# Altium project PCB_3U_Kasli.PrjPCB (part 1 of 6)
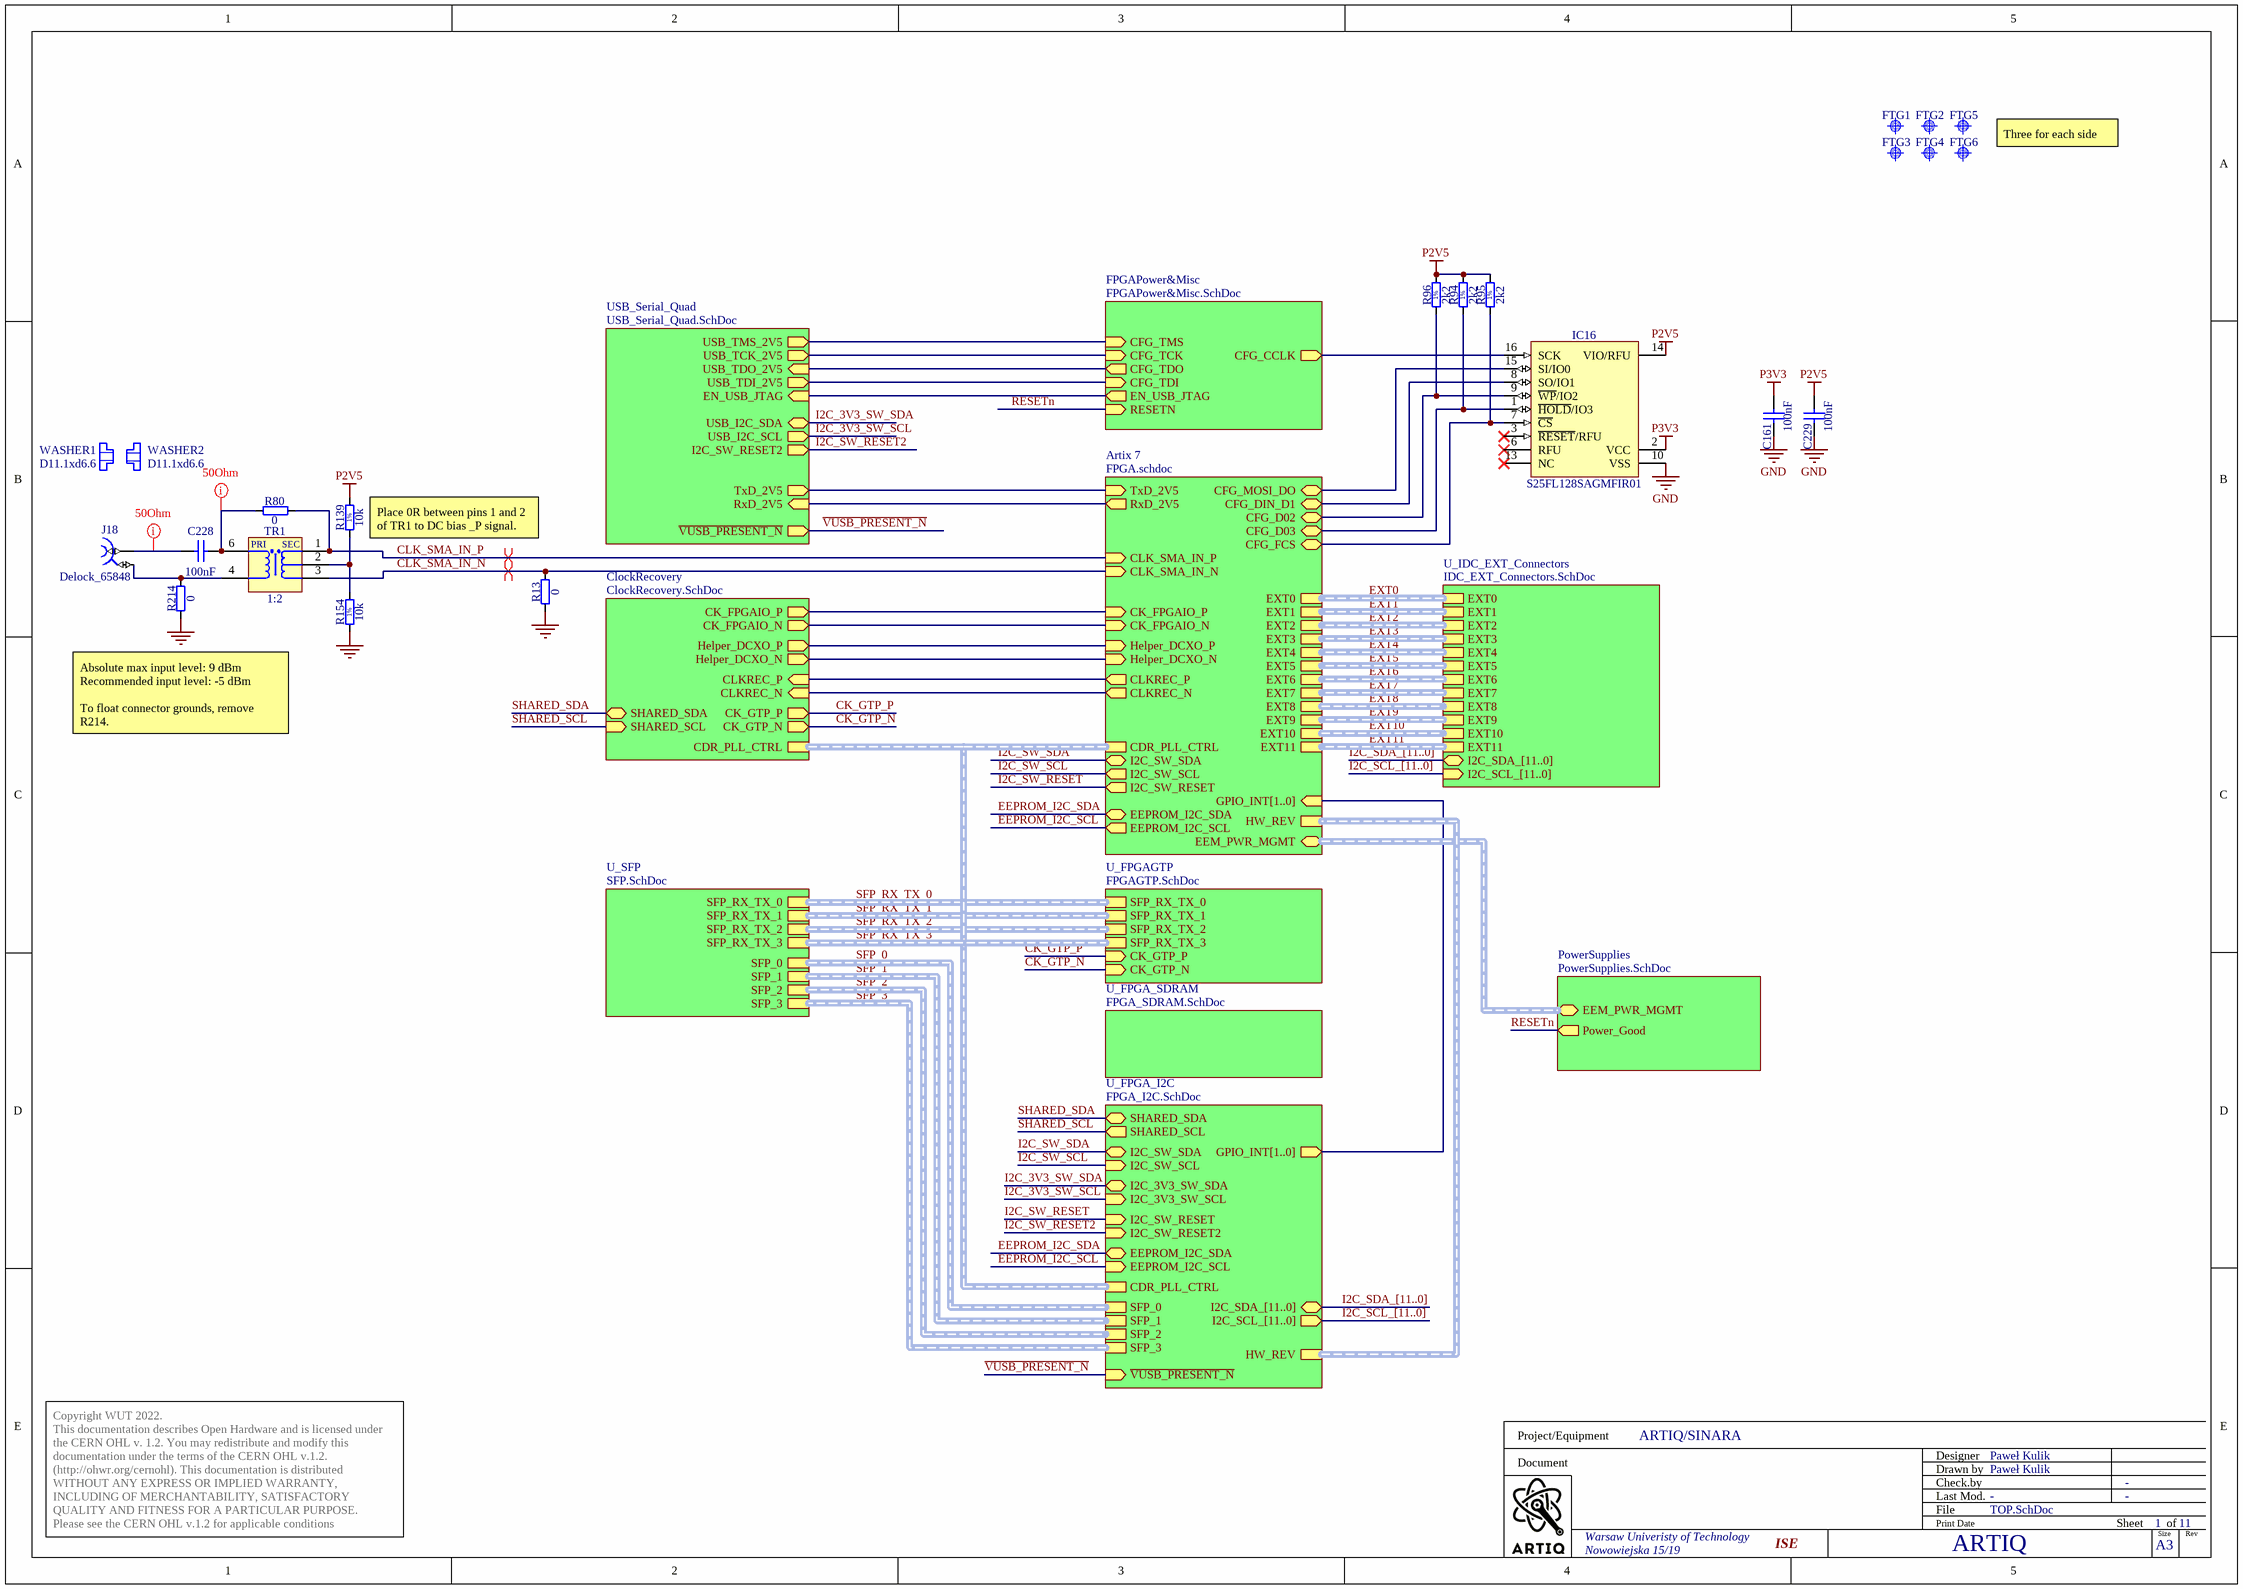
[diagram p0: TOP.SchDoc]
11 sheets, 786 parts. Net scope: hierarchical (ports join the sheet entries above them; power ports are global).
Board file: PCB_Kasli.PCBDOC
Sheets:
  TOP.SchDoc
    Artix 7 = FPGA.schdoc
    ClockRecovery = ClockRecovery.SchDoc
    PowerSupplies = PowerSupplies.SchDoc
    U_SFP = SFP.SchDoc
    FPGAPower&Misc = FPGAPower&Misc.SchDoc
    U_FPGAGTP = FPGAGTP.SchDoc
    U_FPGA_I2C = FPGA_I2C.SchDoc
    U_FPGA_SDRAM = FPGA_SDRAM.SchDoc
    U_IDC_EXT_Connectors = IDC_EXT_Connectors.SchDoc
    USB_Serial_Quad = USB_Serial_Quad.SchDoc

## Sheet TOP.SchDoc: =ProjectName
size 420 x 297 mm; Author: Paweł Kulik; CompanyName: WUT; DrawnBy: Paweł Kulik; Organization: WUT ISE; Address1: Warsaw Univeristy of Technology; Address2: Nowowiejska 15/19; DocumentNumber: 1; Revision: 2.0.2; SheetNumber: 1; SheetTotal: 11; EDA_Number: ARTIQ; Projet: ARTIQ/SINARA; ModifiedBy: -; CheckedDate: -; Title2: TOP.SchDoc; DivGrp: ISE; Designer: Paweł Kulik; ModifiedDate: -; ProjectName: ARTIQ/SINARA

### Parts
C161  100nF  [CAPC0603X33N]
C228  100nF  [CAPC0603X33N]
C229  100nF  [CAPC0603X33N]
FTG1  Use only in PCB  [FIDUCIAL_TOP_C100-200]  (value not drawn)  (no BOM)
FTG2  Use only in PCB  [FIDUCIAL_TOP_S100-200]  (value not drawn)  (no BOM)
FTG3  Use only in PCB  [FIDUCIAL_TOP_C100-200]  (value not drawn)  (no BOM)
FTG4  Use only in PCB  [FIDUCIAL_TOP_C100-200]  (value not drawn)  (no BOM)
FTG5  Use only in PCB  [FIDUCIAL_TOP_C100-200]  (value not drawn)  (no BOM)
FTG6  Use only in PCB  [FIDUCIAL_TOP_S100-200]  (value not drawn)  (no BOM)
IC16  S25FL128SAGMFIR01  [SOIC127P1030X265-16N]
J18  Delock_65848  [Delock_65848]
R13  0  [RESC1005X40N]
R80  0  [RESC1005X40N]
R94  2k2  [RESC1005X40N]
R95  2k2  [RESC1005X40N]
R96  2k2  [RESC1005X40N]
R139  10k  [RESC1005X40N]
R154  10k  [RESC1005X40N]
R214  0  [RESC1005X40N]
TR1  1:2  [XFMR_MINI-CIRCUITS_AT1521]
WASHER1  D11.1xd6.6  [Keystone_7687]
WASHER2  D11.1xd6.6  [Keystone_7687]

### Sub-sheets
Artix 7 = FPGA.schdoc: CLKREC_P (out), CLKREC_N (out), CK_FPGAIO_P (in), CK_FPGAIO_N (in), I2C_SW_SDA (bidir), I2C_SW_SCL (out), CFG_MOSI_DO (bidir), CFG_DIN_D1 (bidir), CFG_D02 (bidir), CFG_D03 (bidir), CFG_FCS (bidir), TxD_2V5 (in), RxD_2V5 (out), GPIO_INT[1..0] (in), CDR_PLL_CTRL (harness CDR_PLL_CTRL), CLK_SMA_IN_P (in), Helper_DCXO_N (in), Helper_DCXO_P (in), I2C_SW_RESET (out), CLK_SMA_IN_N (in), EXT9 (harness ExtensionConnector), EXT7 (harness ExtensionConnector), EXT6 (harness ExtensionConnector), EXT11 (harness ExtensionConnector), EXT8 (harness ExtensionConnector), EXT10 (harness ExtensionConnector), EXT5 (harness ExtensionConnector), EXT4 (harness ExtensionConnector), EXT3 (harness ExtensionConnector), EXT2 (harness ExtensionConnector), EXT1 (harness ExtensionConnector), EXT0 (harness ExtensionConnector), EEPROM_I2C_SCL (out), EEPROM_I2C_SDA (bidir), EEM_PWR_MGMT (bidir), HW_REV
ClockRecovery = ClockRecovery.SchDoc: CLKREC_P (in), CLKREC_N (in), SHARED_SDA (bidir), SHARED_SCL (in), CK_GTP_P (out), CK_GTP_N (out), CK_FPGAIO_P (out), CK_FPGAIO_N (out), CDR_PLL_CTRL (harness CDR_PLL_CTRL), Helper_DCXO_N (out), Helper_DCXO_P (out)
FPGAPower&Misc = FPGAPower&Misc.SchDoc: RESETN (in), CFG_CCLK (out), CFG_TMS (in), CFG_TCK (in), CFG_TDO (out), CFG_TDI (in), EN_USB_JTAG (out)
PowerSupplies = PowerSupplies.SchDoc: Power_Good (out), EEM_PWR_MGMT (bidir)
U_FPGA_I2C = FPGA_I2C.SchDoc: I2C_SDA_[11..0] (bidir), I2C_SW_SDA (bidir), I2C_SCL_[11..0] (out), SHARED_SDA (bidir), SHARED_SCL (out), I2C_SW_SCL (in), I2C_3V3_SW_SCL (in), I2C_3V3_SW_SDA (bidir), I2C_SW_RESET (in), SFP_0 (harness SFP), SFP_2 (harness SFP), SFP_1 (harness SFP), ~{VUSB_PRESENT_N} (in), GPIO_INT[1..0] (out), CDR_PLL_CTRL (harness CDR_PLL_CTRL), SFP_3 (harness SFP), I2C_SW_RESET2 (in), EEPROM_I2C_SDA (bidir), EEPROM_I2C_SCL (in), HW_REV (harness HW_REV)
U_FPGA_SDRAM = FPGA_SDRAM.SchDoc: no entries
U_FPGAGTP = FPGAGTP.SchDoc: SFP_RX_TX_0 (harness SFP_RX_TX), SFP_RX_TX_1 (harness SFP_RX_TX), SFP_RX_TX_2 (harness SFP_RX_TX), CK_GTP_P (in), CK_GTP_N (in), SFP_RX_TX_3 (harness SFP_RX_TX)
U_IDC_EXT_Connectors = IDC_EXT_Connectors.SchDoc: I2C_SDA_[11..0] (bidir), I2C_SCL_[11..0] (in), EXT7 (harness ExtensionConnector), EXT9 (harness ExtensionConnector), EXT11 (harness ExtensionConnector), EXT6 (harness ExtensionConnector), EXT2 (harness ExtensionConnector), EXT10 (harness ExtensionConnector), EXT8 (harness ExtensionConnector), EXT5 (harness ExtensionConnector), EXT3 (harness ExtensionConnector), EXT4 (harness ExtensionConnector), EXT0 (harness ExtensionConnector), EXT1 (harness ExtensionConnector)
U_SFP = SFP.SchDoc: SFP_0 (harness SFP), SFP_RX_TX_0 (harness SFP_RX_TX), SFP_2 (harness SFP), SFP_RX_TX_1 (harness SFP_RX_TX), SFP_RX_TX_2 (harness SFP_RX_TX), SFP_1 (harness SFP), SFP_3 (harness SFP), SFP_RX_TX_3 (harness SFP_RX_TX)
USB_Serial_Quad = USB_Serial_Quad.SchDoc: USB_TDO_2V5 (in), RxD_2V5 (in), USB_TMS_2V5 (out), USB_TDI_2V5 (out), USB_TCK_2V5 (out), TxD_2V5 (out), EN_USB_JTAG (in), USB_I2C_SCL (out), USB_I2C_SDA (bidir), ~{VUSB_PRESENT_N} (out), I2C_SW_RESET2 (out)

### Nets
GND: C161.1 C229.1 IC16.10(VSS) R13.1 R154.2 R214.1
P2V5: C229.2 IC16.14(VIO/RFU) R94.2 R95.2 R96.2 R139.1
P3V3: C161.2 IC16.2(VCC)
~{VUSB_PRESENT_N}: sheet U_FPGA_I2C/~{VUSB_PRESENT_N}, sheet USB_Serial_Quad/~{VUSB_PRESENT_N}
CFG_CCLK: IC16.16(SCK) ; sheet FPGAPower&Misc/CFG_CCLK
CFG_D02: IC16.9(~{WP}/IO2) R96.1 ; sheet Artix 7/CFG_D02
CFG_D03: IC16.1(~{HOLD}/IO3) R94.1 ; sheet Artix 7/CFG_D03
CFG_DIN: IC16.8(SO/IO1) ; sheet Artix 7/CFG_DIN_D1
CFG_FCS: IC16.7(~{CS}) R95.1 ; sheet Artix 7/CFG_FCS
CFG_MOSI: IC16.15(SI/IO0) ; sheet Artix 7/CFG_MOSI_DO
CFG_TCK: sheet FPGAPower&Misc/CFG_TCK, sheet USB_Serial_Quad/USB_TCK_2V5
CFG_TDI: sheet FPGAPower&Misc/CFG_TDI, sheet USB_Serial_Quad/USB_TDI_2V5
CFG_TDO: sheet FPGAPower&Misc/CFG_TDO, sheet USB_Serial_Quad/USB_TDO_2V5
CFG_TMS: sheet FPGAPower&Misc/CFG_TMS, sheet USB_Serial_Quad/USB_TMS_2V5
CK_FPGAIO_N: sheet Artix 7/CK_FPGAIO_N, sheet ClockRecovery/CK_FPGAIO_N
CK_FPGAIO_P: sheet Artix 7/CK_FPGAIO_P, sheet ClockRecovery/CK_FPGAIO_P
CK_GTP_N: sheet ClockRecovery/CK_GTP_N, sheet U_FPGAGTP/CK_GTP_N
CK_GTP_P: sheet ClockRecovery/CK_GTP_P, sheet U_FPGAGTP/CK_GTP_P
CLK_SMA_IN_N: R13.2 TR1.3(S) ; sheet Artix 7/CLK_SMA_IN_N
CLK_SMA_IN_P: R80.2 TR1.1(SDOT) ; sheet Artix 7/CLK_SMA_IN_P
CLKREC_N: sheet Artix 7/CLKREC_N, sheet ClockRecovery/CLKREC_N
CLKREC_P: sheet Artix 7/CLKREC_P, sheet ClockRecovery/CLKREC_P
EEPROM_I2C_SCL: sheet Artix 7/EEPROM_I2C_SCL, sheet U_FPGA_I2C/EEPROM_I2C_SCL
EEPROM_I2C_SDA: sheet Artix 7/EEPROM_I2C_SDA, sheet U_FPGA_I2C/EEPROM_I2C_SDA
Helper_DCXO_N: sheet Artix 7/Helper_DCXO_N, sheet ClockRecovery/Helper_DCXO_N
Helper_DCXO_P: sheet Artix 7/Helper_DCXO_P, sheet ClockRecovery/Helper_DCXO_P
I2C_3V3_SW_SCL: sheet U_FPGA_I2C/I2C_3V3_SW_SCL, sheet USB_Serial_Quad/USB_I2C_SCL
I2C_3V3_SW_SDA: sheet U_FPGA_I2C/I2C_3V3_SW_SDA, sheet USB_Serial_Quad/USB_I2C_SDA
I2C_SW_RESET: sheet Artix 7/I2C_SW_RESET, sheet U_FPGA_I2C/I2C_SW_RESET
I2C_SW_RESET2: sheet U_FPGA_I2C/I2C_SW_RESET2, sheet USB_Serial_Quad/I2C_SW_RESET2
I2C_SW_SCL: sheet Artix 7/I2C_SW_SCL, sheet U_FPGA_I2C/I2C_SW_SCL
I2C_SW_SDA: sheet Artix 7/I2C_SW_SDA, sheet U_FPGA_I2C/I2C_SW_SDA
RESETn: sheet PowerSupplies/Power_Good, sheet FPGAPower&Misc/RESETN
RxD_2V5: sheet Artix 7/RxD_2V5, sheet USB_Serial_Quad/RxD_2V5
SHARED_SCL: sheet ClockRecovery/SHARED_SCL, sheet U_FPGA_I2C/SHARED_SCL
SHARED_SDA: sheet ClockRecovery/SHARED_SDA, sheet U_FPGA_I2C/SHARED_SDA
TxD_2V5: sheet Artix 7/TxD_2V5, sheet USB_Serial_Quad/TxD_2V5
NetC53_2: sheet FPGAPower&Misc/EN_USB_JTAG, sheet USB_Serial_Quad/EN_USB_JTAG
NetC228_1: C228.1 J18.1
NetC228_2: C228.2 R80.1 TR1.6(PDOT)
NetJ18_2: J18.2 R214.2 TR1.4(P)
NetR139_2: R139.2 R154.1 TR1.2(NC)

Not connected (* = marked no-connect by the designer): IC16 3(~{RESET}/RFU)* 6(RFU)* 13(NC)*

### Buses and harness runs
bus I2C_SCL_[11..0] = sheet U_FPGA_I2C/I2C_SCL_[11..0]
bus I2C_SCL_[11..0] = sheet U_IDC_EXT_Connectors/I2C_SCL_[11..0]
bus I2C_SDA_[11..0] = sheet U_FPGA_I2C/I2C_SDA_[11..0]
bus I2C_SDA_[11..0] = sheet U_IDC_EXT_Connectors/I2C_SDA_[11..0]
bus sheet Artix 7/GPIO_INT[1..0] = sheet U_FPGA_I2C/GPIO_INT[1..0]
harness EXT0 = sheet Artix 7/EXT0 = sheet U_IDC_EXT_Connectors/EXT0
harness EXT1 = sheet Artix 7/EXT1 = sheet U_IDC_EXT_Connectors/EXT1
harness EXT2 = sheet Artix 7/EXT2 = sheet U_IDC_EXT_Connectors/EXT2
harness EXT3 = sheet Artix 7/EXT3 = sheet U_IDC_EXT_Connectors/EXT3
harness EXT4 = sheet Artix 7/EXT4 = sheet U_IDC_EXT_Connectors/EXT4
harness EXT5 = sheet Artix 7/EXT5 = sheet U_IDC_EXT_Connectors/EXT5
harness EXT6 = sheet Artix 7/EXT6 = sheet U_IDC_EXT_Connectors/EXT6
harness EXT7 = sheet Artix 7/EXT7 = sheet U_IDC_EXT_Connectors/EXT7
harness EXT8 = sheet Artix 7/EXT8 = sheet U_IDC_EXT_Connectors/EXT8
harness EXT9 = sheet Artix 7/EXT9 = sheet U_IDC_EXT_Connectors/EXT9
harness EXT10 = sheet Artix 7/EXT10 = sheet U_IDC_EXT_Connectors/EXT10
harness EXT11 = sheet Artix 7/EXT11 = sheet U_IDC_EXT_Connectors/EXT11
harness SFP_0 = sheet U_FPGA_I2C/SFP_0 = sheet U_SFP/SFP_0
harness SFP_1 = sheet U_FPGA_I2C/SFP_1 = sheet U_SFP/SFP_1
harness SFP_2 = sheet U_FPGA_I2C/SFP_2 = sheet U_SFP/SFP_2
harness SFP_3 = sheet U_FPGA_I2C/SFP_3 = sheet U_SFP/SFP_3
harness SFP_RX_TX_0 = sheet U_FPGAGTP/SFP_RX_TX_0 = sheet U_SFP/SFP_RX_TX_0
harness SFP_RX_TX_1 = sheet U_FPGAGTP/SFP_RX_TX_1 = sheet U_SFP/SFP_RX_TX_1
harness SFP_RX_TX_2 = sheet U_FPGAGTP/SFP_RX_TX_2 = sheet U_SFP/SFP_RX_TX_2
harness SFP_RX_TX_3 = sheet U_FPGAGTP/SFP_RX_TX_3 = sheet U_SFP/SFP_RX_TX_3
harness sheet Artix 7/CDR_PLL_CTRL = sheet ClockRecovery/CDR_PLL_CTRL = sheet U_FPGA_I2C/CDR_PLL_CTRL
harness sheet Artix 7/EEM_PWR_MGMT = sheet PowerSupplies/EEM_PWR_MGMT
harness sheet Artix 7/HW_REV = sheet U_FPGA_I2C/HW_REV

### Layout directives
net class 50Ohm: NetC228_1, NetC228_2
differential pair; differential pair class Diff_100Ohm: CLK_SMA_IN_N, CLK_SMA_IN_P

### Notes on the sheet
- Three for each side
- (near R139) Place 0R between pins 1 and 2 of TR1 to DC bias _P signal.
- (near R214) Absolute max input level: 9 dBm
  Recommended input level: -5 dBm
  To float connector grounds, remove R214.
- Project/Equipment
- Document
- Designer
- Drawn by
- Check.by
- Copyright WUT 2022.
  This documentation describes Open Hardware and is licensed under the CERN OHL v. 1.2. You may redistribute and modify this documentation under the terms of the CERN OHL v.1.2. (http://ohwr.org/cernohl). This documentation is distributed WITHOUT ANY EXPRESS OR IMPLIED WARRANTY, INCLUDING OF MERCHANTABILITY, SATISFACTORY QUALITY AND FITNESS FOR A PARTICULAR PURPOSE. Please see the CERN OHL v.1.2 for applicable conditions
- File
- Last Mod.
- Print Date
- Sheet
- Size
- A3
- of
- Rev
- (in symbol R0402_2K2_1%_0.0625W_100PPM) 1%
- (in symbol R0402_10K_1%_0.0625W_100PPM) 1%
- (in symbol XFMR_MINI-CIRCUITS_TC2-1TX+) PRI; SEC

### Library data of the parts
C161 C228 C229 = CC0201_100NF_6.3V_10%_X5R: Non-polarised capacitor; Part Description: SMD Multilayer Chip Ceramic Capacitor; Manufacturer: GENERIC; Manufacturer1 Part Number: 02016D104KAT2A; Voltage: 6.3V; TC: X5R; Tolerance: ±10%; Part Number: CC0201_100NF_6.3V_10%_X5R; Component Kind: Standard; Component Type: Standard; Pin Count: 2; Value: 100nF; Status: Not Recommended; Manufacturer Part Number: CC0201_100NF_6.3V_10%_X5R; Case: 0201; Mounted: Yes; Socket: No; SMD: Yes; Sense: No; Manufacturer1 Example: AVX; Manufacturer1 ComponentHeight: 0.33mm; HelpURL: \\cern.ch\dfs\Applications\Altium\Datasheets\CC0201_X5R_AVX.pdf; Author: CERN DEM JLC
  C161 C229: CreateDate: 03.12.2007; LatestRevisionDate: 03.12.2007; ClassName: Artix
  C228: CreateDate: 2007-12-03; LatestRevisionDate: 2007-12-03
FTG1 FTG3-FTG5 = FIDUCIAL_TARGET_C100-200: Fiducial Target; Part Description: Round Fiducial Target, Top Layer, 1.0mm, Top Solder 2.0mm, Keepout =2.0mm; Mounted: No; Part Number: FIDUCIAL_TARGET_C100-200; Component Type: Standard (No BOM); Pin Count: 1; Family: Fiducial; Socket: No; SMD: Yes; Sense: No; Status: None; ComponentHeight: 0mm; HelpURL: Undefined; Author: CERN DEM JLC; CreateDate: 09.02.2010; LatestRevisionDate: 04.04.2012; PackageDescription: Round Fiducial Target, Top Layer, 1.0mm, Top Solder 2.0mm, Keepout =2.0mm
FTG2 FTG6 = FIDUCIAL_TARGET_S100-200: Fiducial Target; Part Description: Square Fiducial Target, Top Layer, 1.0mm, Top Solder 2.0mm, Keepout =2.0mm; Mounted: No; Part Number: FIDUCIAL_TARGET_S100-200; Component Type: Standard (No BOM); Pin Count: 1; Family: Fiducial; Socket: No; SMD: Yes; Sense: No; Status: None; ComponentHeight: 0mm; HelpURL: Undefined; Author: CERN DEM JLC; CreateDate: 09.02.2010; LatestRevisionDate: 04.04.2012; PackageDescription: Square Fiducial Target, Top Layer, 1.0mm, Top Solder 2.0mm, Keepout =2.0mm
IC16 = S25FL128SAGMFIR01: 128Mbit, MirrorBit® Flash Non-Volatile Memory CMOS 3.0 Volt Core with Versatile I/O Serial Peripheral Interface with Multi-I/O; Part Description: 128Mbit, 133MHz, MirrorBit® Flash Non-Volatile Memory CMOS 3V Core with Versatile I/O Serial Peripheral Interface with Multi-I/O; Manufacturer: SPANSION; PressFit: No; Bonding: No; Part Number: S25FL128SAGMFIR01; Component Kind: Standard; Component Type: Standard; Device: S25FL128SAGMFIR01; PackageDescription: SOIC 16, Pitch 1.27mm - Body 7.5x10.3mm, IPC Medium Density; Manufacturer Part Number: S25FL128SAGMFIR01; Pin Count: 11; Case: SOIC16; Mounted: Yes; Socket: No; SMD: Yes; Sense: No; ComponentHeight: 2.65mm; HelpURL: \\cern.ch\dfs\Applications\Altium\Datasheets\S25FL128SAGMFIR01.pdf; Author: CERN DEM JLC; CreateDate: 2014-07-10; LatestRevisionDate: 2014-07-10
J18 = CMP-002-04652-1: SMA connector Delock 65848
R13 R80 R214 = R0402_0R_JUMPER: Resistor; Part Description: 1A (0.05R Max DC Resistance) Zero Ohm Jumper; Manufacturer: GENERIC; Manufacturer1 Part Number: 232270591001L; PressFit: No; Part Number: R0402_0R_JUMPER; Component Kind: Standard; Component Type: Standard; Pin Count: 2; Value: 0; Status: Not Recommended; Manufacturer Part Number: R0402_0R_JUMPER; Case: 0402; Mounted: Yes; Sense: No; Socket: No; SMD: Yes; Manufacturer1 Example: YAGEO PHYCOMP; Manufacturer1 ComponentHeight: 0.4mm; HelpURL: \\cern.ch\dfs\Applications\Altium\Datasheets\R0402_Phycomp_RC0402.pdf; Author: CERN DEM JLC; CreateDate: 03.12.2007; LatestRevisionDate: 17.10.2012
R94-R96 = R0402_2K2_1%_0.0625W_100PPM: Resistor - 1%; Part Description: General Purpose Thick Film Chip Resistor; Manufacturer: GENERIC; Manufacturer1 Part Number: 232270672202L; TC: ±100ppm/°C; PressFit: No; Part Number: R0402_2K2_1%_0.0625W_100PPM; Component Kind: Standard; Component Type: Standard; Pin Count: 2; Value: 2k2; Status: Not Recommended; Power: 0.0625W; Tolerance: ±1%; Manufacturer Part Number: R0402_2K2_1%_0.0625W_100PPM; Case: 0402; Mounted: Yes; Sense: No; Socket: No; SMD: Yes; Manufacturer1 Example: YAGEO PHYCOMP; Manufacturer1 ComponentHeight: 0.4mm; HelpURL: \\cern.ch\dfs\Applications\Altium\Datasheets\R0402_Phycomp_RC0402.pdf; Author: CERN DEM JLC; CreateDate: 03.12.2007; LatestRevisionDate: 17.10.2012; ClassName: Artix
R139 R154 = R0402_10K_1%_0.0625W_100PPM: Resistor - 1%; Part Description: General Purpose Thick Film Chip Resistor; Manufacturer: GENERIC; Manufacturer1 Part Number: 232270671003L; TC: ±100ppm/°C; PressFit: No; Part Number: R0402_10K_1%_0.0625W_100PPM; Component Kind: Standard; Component Type: Standard; Pin Count: 2; Value: 10k; Status: Not Recommended; Power: 0.0625W; Tolerance: ±1%; Manufacturer Part Number: R0402_10K_1%_0.0625W_100PPM; Case: 0402; Mounted: Yes; Sense: No; Socket: No; SMD: Yes; Manufacturer1 Example: YAGEO PHYCOMP; Manufacturer1 ComponentHeight: 0.4mm; HelpURL: \\cern.ch\dfs\Applications\Altium\Datasheets\R0402_Phycomp_RC0402.pdf; Author: CERN DEM JLC; CreateDate: 03.12.2007; LatestRevisionDate: 17.10.2012
TR1 = XFMR_MINI-CIRCUITS_TC2-1TX+: 50 Ohms 3 to 300MHz RF Transformer; Part Number: XFMR_MINI-CIRCUITS_TC2-1TX+; Component Kind: Standard; Component Type: Standard; Pin Count: 5; Value: 1:2; Status: None; Part Description: 50 Ohms 3 to 300MHz RF Transformer; Manufacturer: MINI-CIRCUITS; Manufacturer Part Number: TC2-1TX+; Mounted: Yes; Socket: No; Sense: No; SMD: Yes; ComponentHeight: 4.06mm; HelpURL: \\cern.ch\dfs\Applications\Altium\Datasheets\XFMR_MINI-CIRCUITS_TC2-1TX+.pdf; Author: CERN DEM MR; CreateDate: 18.10.2019; LatestRevisionDate: 18.10.2019
WASHER1 WASHER2 = Keystone_7687: SMA_Shoulder Washer; Part Description: Polyphenylene Sulfide PPS Shoulder Washer; Manufacturer Part Number: 7687; PressFit: No; Part Number: Keystone 7687; Component Kind: Standard; Component Type: Mechanical; Pin Count: 0; PackageDescription: Polyphenylene Sulfide PPS Shoulder Washer; Mounted: Yes; Socket: No; SMD: No; Sense: No; Status: None; Value: D11.1xd6.6; Manufacturer: Keystone; ComponentHeight: 1.91mm; HelpURL: \\cern.ch\dfs\Applications\Altium\Datasheets\AAVID-THERMALLOY_7721-7PPSG.pdf; Author: GK; CreateDate: 28.01.2016; LatestRevisionDate: 28.01.2016

## Sheet FPGA.schdoc: =ProjectName
size 420 x 297 mm; Author: Paweł Kulik; CompanyName: WUT; DrawnBy: Paweł Kulik; Organization: WUT ISE; Address1: Warsaw Univeristy of Technology; Address2: Nowowiejska 15/19; DocumentNumber: 2; Revision: 2.0.1; SheetNumber: 2; SheetTotal: 11; EDA_Number: ARTIQ; Projet: ARTIQ/SINARA; ModifiedBy: -; CheckedDate: -; Title2: FPGA.schdoc; DivGrp: ISE; Designer: Paweł Kulik; ModifiedDate: -; ProjectName: ARTIQ/SINARA
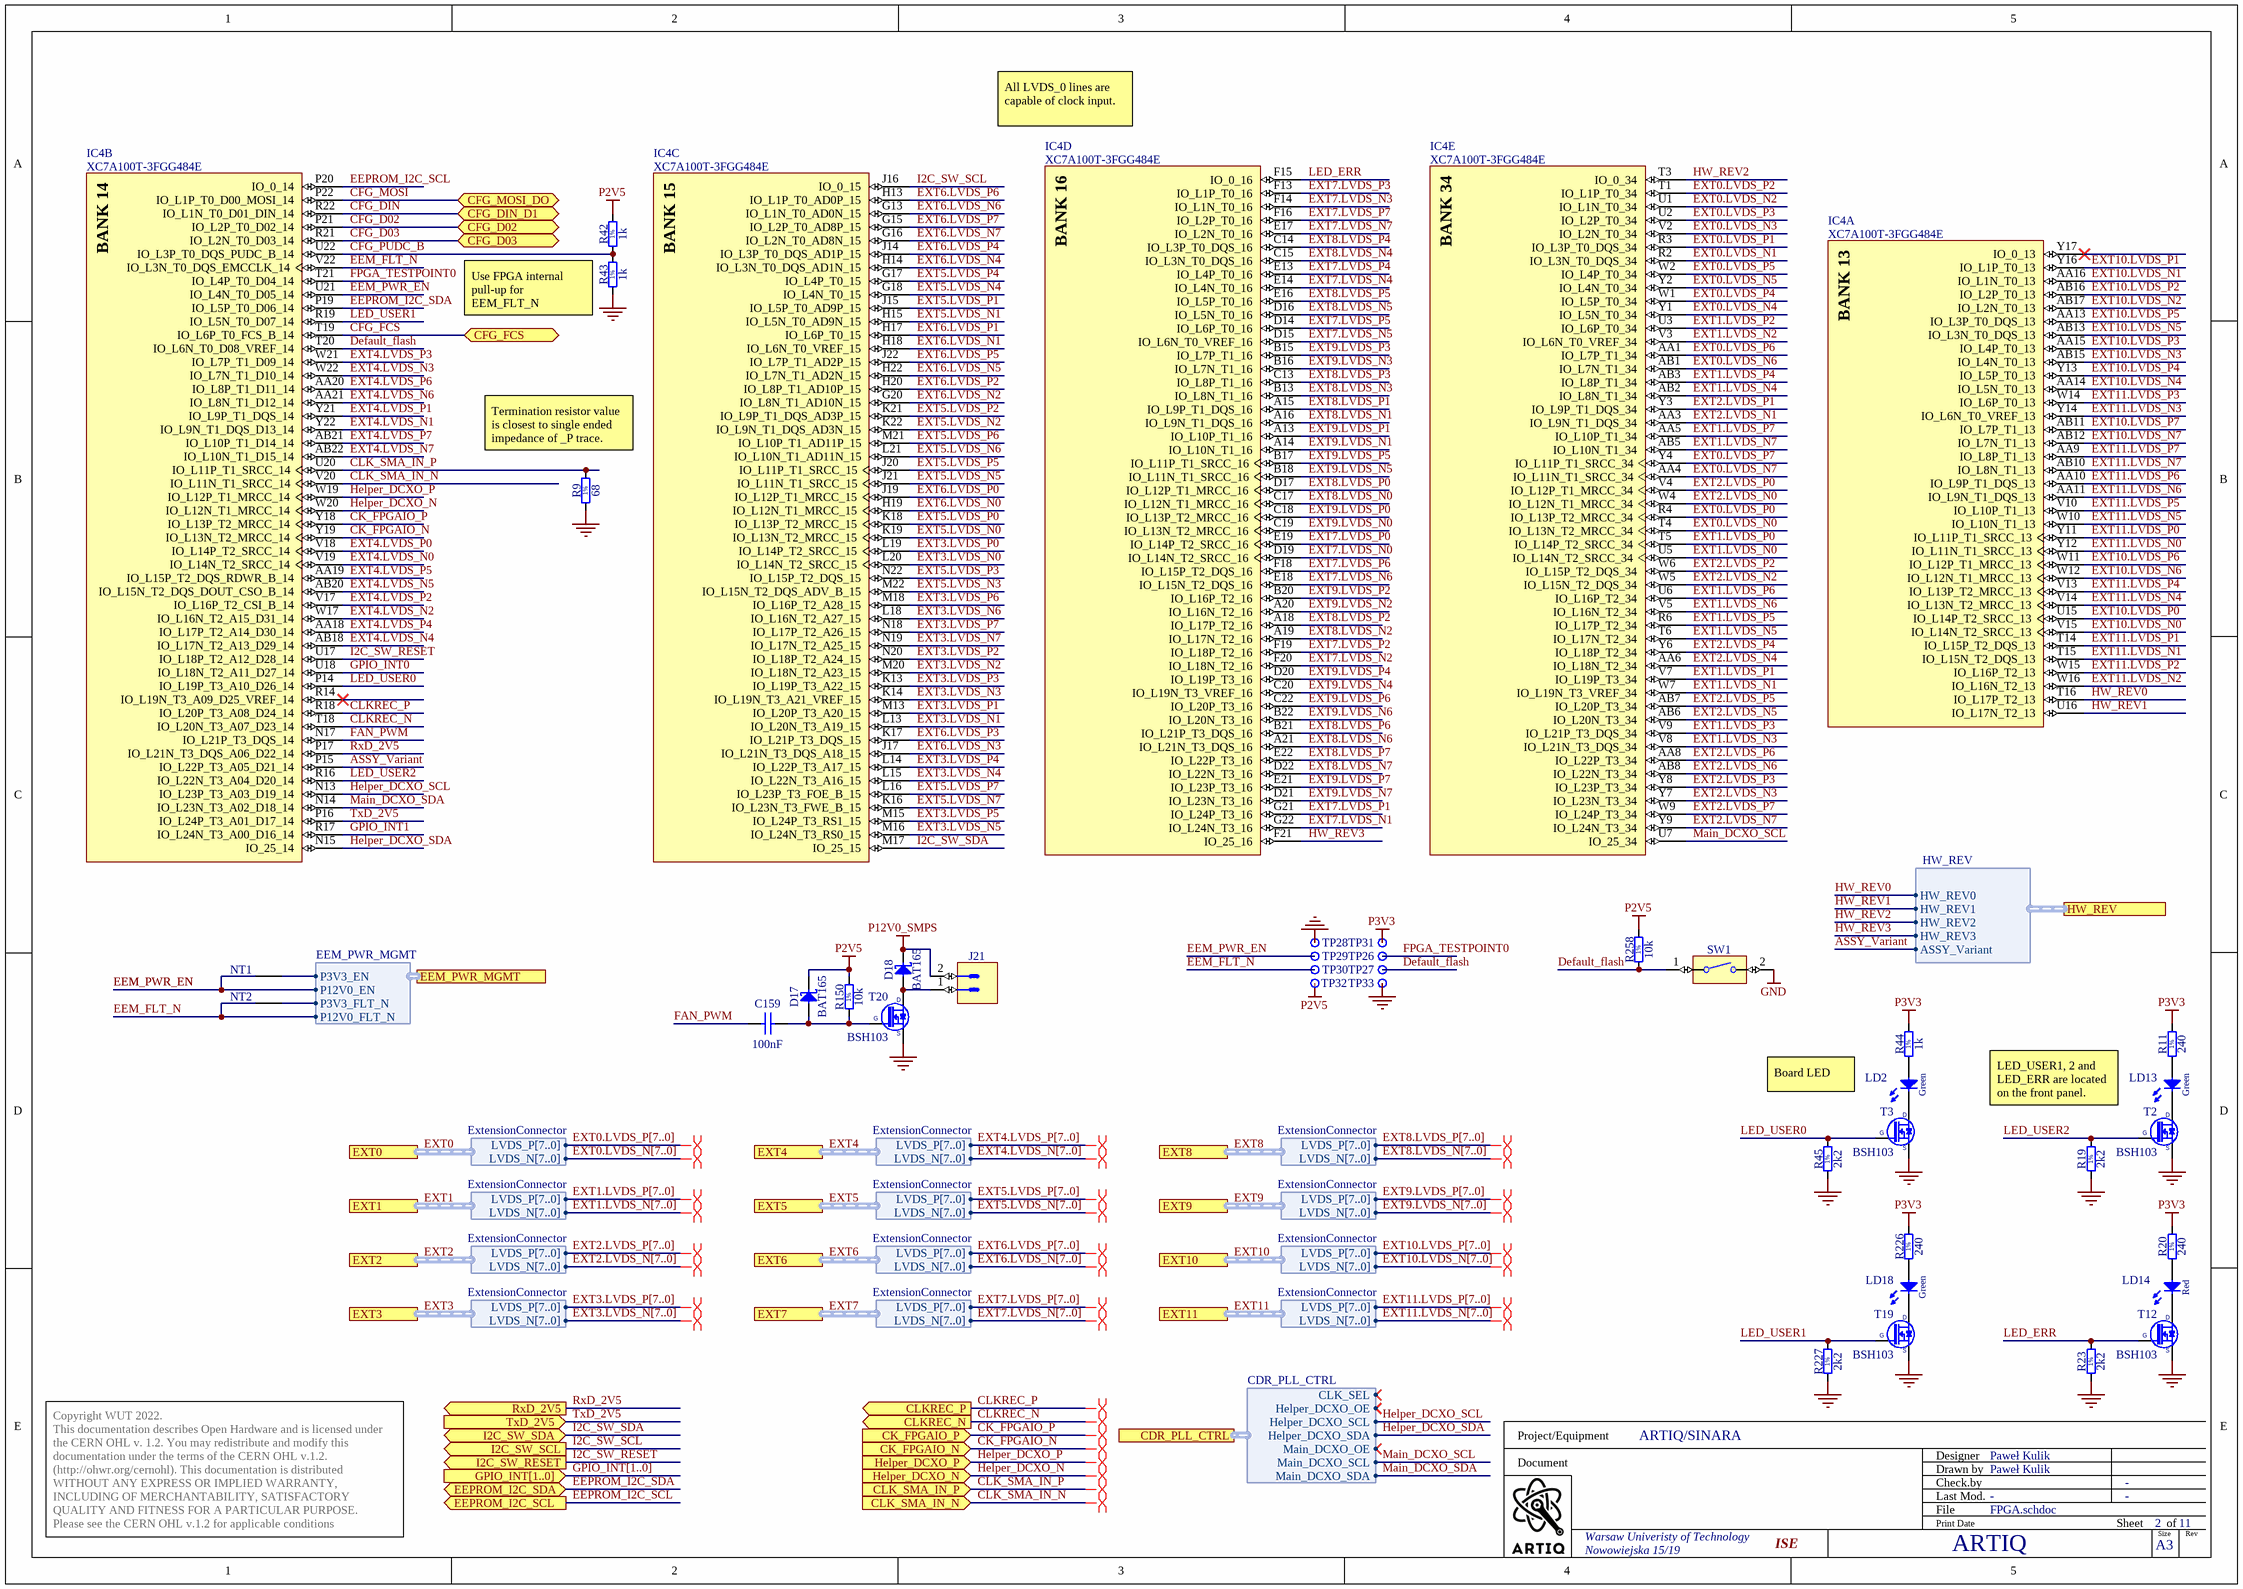
[diagram p1: FPGA.schdoc]

### Parts
C159  100nF  [CAPC0603X33N]
D17  BAT165  [SOD2512X110N]
D18  BAT165  [SOD2512X110N]
IC4  XC7A100T-3FGG484E  [BGA484C100P22X22_2300X2300X260]  (parts A,B,C,D,E of 10)
J21  KK®  [MOLEX_22-27-2021]  (value not drawn)
LD2  Green  [LED_KINGBRIGHT_KPH-1608CGCK]
LD13  Green  [LED_AVAGO_HSME-C120]
LD14  Red  [LED_AVAGO_HSMC-C120]
LD18  Green  [LED_AVAGO_HSME-C120]
NT1  Net Tie  [Net Tie]  (value not drawn)  (net tie, no BOM)
NT2  Net Tie  [Net Tie]  (value not drawn)  (net tie, no BOM)
R9  68  [RESC1005X40N]
R11  240  [RESC1005X40N]
R19  2k2  [RESC1005X40N]
R20  240  [RESC1005X40N]
R23  2k2  [RESC1005X40N]
R42  1k  [RESC1005X40N]
R43  1k  [RESC1005X40N]
R44  1k  [RESC1005X40N]
R45  2k2  [RESC1005X40N]
R150  10k  [RESC1005X40N]
R226  240  [RESC1005X40N]
R227  2k2  [RESC1005X40N]
R258  10k  [RESC1005X40N]
SW1  Switch  [SW_OMRON_B3U-3000PM]  (value not drawn)
T2  BSH103  [SOT95P230X110-3N]
T3  BSH103  [SOT95P230X110-3N]
T12  BSH103  [SOT95P230X110-3N]
T19  BSH103  [SOT95P230X110-3N]
T20  BSH103  [SOT95P230X110-3N]
TP26  Plated Hole  [c170h100]  (value not drawn)  (no BOM)
TP27  Plated Hole  [c170h100]  (value not drawn)  (no BOM)
TP28  Plated Hole  [c170h100]  (value not drawn)  (no BOM)
TP29  Plated Hole  [c170h100]  (value not drawn)  (no BOM)
TP30  Plated Hole  [c170h100]  (value not drawn)  (no BOM)
TP31  Plated Hole  [c170h100]  (value not drawn)  (no BOM)
TP32  Plated Hole  [c170h100]  (value not drawn)  (no BOM)
TP33  Plated Hole  [c170h100]  (value not drawn)  (no BOM)

### Ports
CDR_PLL_CTRL (harness CDR_PLL_CTRL), CFG_D02 (bidir), CFG_D03 (bidir), CFG_DIN_D1 (bidir), CFG_FCS (bidir), CFG_MOSI_DO (bidir), CK_FPGAIO_N (in), CK_FPGAIO_P (in), CLK_SMA_IN_N (in), CLK_SMA_IN_P (in), CLKREC_N (out), CLKREC_P (out), EEM_PWR_MGMT (harness EEM_PWR_MGMT), EEPROM_I2C_SCL (out), EEPROM_I2C_SDA (bidir), EXT0 (harness ExtensionConnector), EXT1 (harness ExtensionConnector), EXT2 (harness ExtensionConnector), EXT3 (harness ExtensionConnector), EXT4 (harness ExtensionConnector), EXT5 (harness ExtensionConnector), EXT6 (harness ExtensionConnector), EXT7 (harness ExtensionConnector), EXT8 (harness ExtensionConnector), EXT9 (harness ExtensionConnector), EXT10 (harness ExtensionConnector), EXT11 (harness ExtensionConnector), GPIO_INT[1..0] (in), Helper_DCXO_N (in), Helper_DCXO_P (in), HW_REV (harness HW_REV), I2C_SW_RESET (out), I2C_SW_SCL (out), I2C_SW_SDA (bidir), RxD_2V5 (out), TxD_2V5 (in)

### Harnesses
ExtensionConnector: LVDS_N[7..0], LVDS_P[7..0]
CDR_PLL_CTRL: CLK_SEL, Helper_DCXO_OE, Helper_DCXO_SCL, Helper_DCXO_SDA, Main_DCXO_OE, Main_DCXO_SCL, Main_DCXO_SDA
EEM_PWR_MGMT: P3V3_EN, P12V0_EN, P3V3_FLT_N, P12V0_FLT_N
HW_REV: ASSY_Variant, HW_REV3, HW_REV2, HW_REV1, HW_REV0

### Nets
GND: R9.1 R19.1 R23.1 R43.1 R45.1 R227.1 SW1.2 T2.2(S) T3.2(S) T12.2(S) T19.2(S) T20.2(S) TP28.1 TP33.1
P2V5: D17.1(C) R42.2 R150.2 R258.2 TP32.1
P3V3: R11.2 R20.2 R44.2 R226.2 TP31.1
P12V0_SMPS: D18.1(C) J21.2
ASSY_Variant: IC4.P15(IO_L22P_T3_A05_D21_14) ; port HW_REV.ASSY_Variant
CFG_D02: IC4.P21(IO_L2P_T0_D02_14) ; port CFG_D02
CFG_D03: IC4.R21(IO_L2N_T0_D03_14) ; port CFG_D03
CFG_DIN: IC4.R22(IO_L1N_T0_D01_DIN_14) ; port CFG_DIN_D1
CFG_FCS: IC4.T19(IO_L6P_T0_FCS_B_14) ; port CFG_FCS
CFG_MOSI: IC4.P22(IO_L1P_T0_D00_MOSI_14) ; port CFG_MOSI_DO
CFG_PUDC_B: IC4.U22(IO_L3P_T0_DQS_PUDC_B_14) R42.1 R43.2
CK_FPGAIO_N: IC4.Y19(IO_L13N_T2_MRCC_14) ; port CK_FPGAIO_N
CK_FPGAIO_P: IC4.Y18(IO_L13P_T2_MRCC_14) ; port CK_FPGAIO_P
CLK_SMA_IN_N: IC4.V20(IO_L11N_T1_SRCC_14) ; port CLK_SMA_IN_N
CLK_SMA_IN_P: IC4.U20(IO_L11P_T1_SRCC_14) R9.2 ; port CLK_SMA_IN_P
CLKREC_N: IC4.T18(IO_L20N_T3_A07_D23_14) ; port CLKREC_N
CLKREC_P: IC4.R18(IO_L20P_T3_A08_D24_14) ; port CLKREC_P
Default_flash: IC4.T20(IO_L6N_T0_D08_VREF_14) R258.1 SW1.1 TP27.1
EEM_FLT_N: IC4.V22(IO_L3N_T0_DQS_EMCCLK_14) NT2.1 TP30.1 ; port EEM_PWR_MGMT.P12V0_FLT_N
EEM_PWR_EN: IC4.U21(IO_L4N_T0_D05_14) NT1.1 TP29.1 ; port EEM_PWR_MGMT.P12V0_EN
EEPROM_I2C_SCL: IC4.P20(IO_0_14) ; port EEPROM_I2C_SCL
EEPROM_I2C_SDA: IC4.P19(IO_L5P_T0_D06_14) ; port EEPROM_I2C_SDA
EXT0.LVDS_N0: IC4.T4(IO_L13N_T2_MRCC_34)
EXT0.LVDS_N1: IC4.R2(IO_L3N_T0_DQS_34)
EXT0.LVDS_N2: IC4.U1(IO_L1N_T0_34)
EXT0.LVDS_N3: IC4.V2(IO_L2N_T0_34)
EXT0.LVDS_N4: IC4.Y1(IO_L5N_T0_34)
EXT0.LVDS_N5: IC4.Y2(IO_L4N_T0_34)
EXT0.LVDS_N6: IC4.AB1(IO_L7N_T1_34)
EXT0.LVDS_N7: IC4.AA4(IO_L11N_T1_SRCC_34)
EXT0.LVDS_P0: IC4.R4(IO_L13P_T2_MRCC_34)
EXT0.LVDS_P1: IC4.R3(IO_L3P_T0_DQS_34)
EXT0.LVDS_P2: IC4.T1(IO_L1P_T0_34)
EXT0.LVDS_P3: IC4.U2(IO_L2P_T0_34)
EXT0.LVDS_P4: IC4.W1(IO_L5P_T0_34)
EXT0.LVDS_P5: IC4.W2(IO_L4P_T0_34)
EXT0.LVDS_P6: IC4.AA1(IO_L7P_T1_34)
EXT0.LVDS_P7: IC4.Y4(IO_L11P_T1_SRCC_34)
EXT1.LVDS_N0: IC4.U5(IO_L14N_T2_SRCC_34)
EXT1.LVDS_N1: IC4.W7(IO_L19N_T3_VREF_34)
EXT1.LVDS_N2: IC4.V3(IO_L6N_T0_VREF_34)
EXT1.LVDS_N3: IC4.V8(IO_L21N_T3_DQS_34)
EXT1.LVDS_N4: IC4.AB2(IO_L8N_T1_34)
EXT1.LVDS_N5: IC4.T6(IO_L17N_T2_34)
EXT1.LVDS_N6: IC4.V5(IO_L16N_T2_34)
EXT1.LVDS_N7: IC4.AB5(IO_L10N_T1_34)
EXT1.LVDS_P0: IC4.T5(IO_L14P_T2_SRCC_34)
EXT1.LVDS_P1: IC4.V7(IO_L19P_T3_34)
EXT1.LVDS_P2: IC4.U3(IO_L6P_T0_34)
EXT1.LVDS_P3: IC4.V9(IO_L21P_T3_DQS_34)
EXT1.LVDS_P4: IC4.AB3(IO_L8P_T1_34)
EXT1.LVDS_P5: IC4.R6(IO_L17P_T2_34)
EXT1.LVDS_P6: IC4.U6(IO_L16P_T2_34)
EXT1.LVDS_P7: IC4.AA5(IO_L10P_T1_34)
EXT2.LVDS_N0: IC4.W4(IO_L12N_T1_MRCC_34)
EXT2.LVDS_N1: IC4.AA3(IO_L9N_T1_DQS_34)
EXT2.LVDS_N2: IC4.W5(IO_L15N_T2_DQS_34)
EXT2.LVDS_N3: IC4.Y7(IO_L23N_T3_34)
EXT2.LVDS_N4: IC4.AA6(IO_L18N_T2_34)
EXT2.LVDS_N5: IC4.AB6(IO_L20N_T3_34)
EXT2.LVDS_N6: IC4.AB8(IO_L22N_T3_34)
EXT2.LVDS_N7: IC4.Y9(IO_L24N_T3_34)
EXT2.LVDS_P0: IC4.V4(IO_L12P_T1_MRCC_34)
EXT2.LVDS_P1: IC4.Y3(IO_L9P_T1_DQS_34)
EXT2.LVDS_P2: IC4.W6(IO_L15P_T2_DQS_34)
EXT2.LVDS_P3: IC4.Y8(IO_L23P_T3_34)
EXT2.LVDS_P4: IC4.Y6(IO_L18P_T2_34)
EXT2.LVDS_P5: IC4.AB7(IO_L20P_T3_34)
EXT2.LVDS_P6: IC4.AA8(IO_L22P_T3_34)
EXT2.LVDS_P7: IC4.W9(IO_L24P_T3_34)
EXT3.LVDS_N0: IC4.L20(IO_L14N_T2_SRCC_15)
EXT3.LVDS_N1: IC4.L13(IO_L20N_T3_A19_15)
EXT3.LVDS_N2: IC4.M20(IO_L18N_T2_A23_15)
EXT3.LVDS_N3: IC4.K14(IO_L19N_T3_A21_VREF_15)
EXT3.LVDS_N4: IC4.L15(IO_L22N_T3_A16_15)
EXT3.LVDS_N5: IC4.M16(IO_L24N_T3_RS0_15)
EXT3.LVDS_N6: IC4.L18(IO_L16N_T2_A27_15)
EXT3.LVDS_N7: IC4.N19(IO_L17N_T2_A25_15)
EXT3.LVDS_P0: IC4.L19(IO_L14P_T2_SRCC_15)
EXT3.LVDS_P1: IC4.M13(IO_L20P_T3_A20_15)
EXT3.LVDS_P2: IC4.N20(IO_L18P_T2_A24_15)
EXT3.LVDS_P3: IC4.K13(IO_L19P_T3_A22_15)
EXT3.LVDS_P4: IC4.L14(IO_L22P_T3_A17_15)
EXT3.LVDS_P5: IC4.M15(IO_L24P_T3_RS1_15)
EXT3.LVDS_P6: IC4.M18(IO_L16P_T2_A28_15)
EXT3.LVDS_P7: IC4.N18(IO_L17P_T2_A26_15)
EXT4.LVDS_N0: IC4.V19(IO_L14N_T2_SRCC_14)
EXT4.LVDS_N1: IC4.Y22(IO_L9N_T1_DQS_D13_14)
EXT4.LVDS_N2: IC4.W17(IO_L16N_T2_A15_D31_14)
EXT4.LVDS_N3: IC4.W22(IO_L7N_T1_D10_14)
EXT4.LVDS_N4: IC4.AB18(IO_L17N_T2_A13_D29_14)
EXT4.LVDS_N5: IC4.AB20(IO_L15N_T2_DQS_DOUT_CSO_B_14)
EXT4.LVDS_N6: IC4.AA21(IO_L8N_T1_D12_14)
EXT4.LVDS_N7: IC4.AB22(IO_L10N_T1_D15_14)
EXT4.LVDS_P0: IC4.V18(IO_L14P_T2_SRCC_14)
EXT4.LVDS_P1: IC4.Y21(IO_L9P_T1_DQS_14)
EXT4.LVDS_P2: IC4.V17(IO_L16P_T2_CSI_B_14)
EXT4.LVDS_P3: IC4.W21(IO_L7P_T1_D09_14)
EXT4.LVDS_P4: IC4.AA18(IO_L17P_T2_A14_D30_14)
EXT4.LVDS_P5: IC4.AA19(IO_L15P_T2_DQS_RDWR_B_14)
EXT4.LVDS_P6: IC4.AA20(IO_L8P_T1_D11_14)
EXT4.LVDS_P7: IC4.AB21(IO_L10P_T1_D14_14)
EXT5.LVDS_N0: IC4.K19(IO_L13N_T2_MRCC_15)
EXT5.LVDS_N1: IC4.H15(IO_L5N_T0_AD9N_15)
EXT5.LVDS_N2: IC4.K22(IO_L9N_T1_DQS_AD3N_15)
EXT5.LVDS_N3: IC4.M22(IO_L15N_T2_DQS_ADV_B_15)
EXT5.LVDS_N4: IC4.G18(IO_L4N_T0_15)
EXT5.LVDS_N5: IC4.J21(IO_L11N_T1_SRCC_15)
EXT5.LVDS_N6: IC4.L21(IO_L10N_T1_AD11N_15)
EXT5.LVDS_N7: IC4.K16(IO_L23N_T3_FWE_B_15)
EXT5.LVDS_P0: IC4.K18(IO_L13P_T2_MRCC_15)
EXT5.LVDS_P1: IC4.J15(IO_L5P_T0_AD9P_15)
EXT5.LVDS_P2: IC4.K21(IO_L9P_T1_DQS_AD3P_15)
EXT5.LVDS_P3: IC4.N22(IO_L15P_T2_DQS_15)
EXT5.LVDS_P4: IC4.G17(IO_L4P_T0_15)
EXT5.LVDS_P5: IC4.J20(IO_L11P_T1_SRCC_15)
EXT5.LVDS_P6: IC4.M21(IO_L10P_T1_AD11P_15)
EXT5.LVDS_P7: IC4.L16(IO_L23P_T3_FOE_B_15)
EXT6.LVDS_N0: IC4.H19(IO_L12N_T1_MRCC_15)
EXT6.LVDS_N1: IC4.H18(IO_L6N_T0_VREF_15)
EXT6.LVDS_N2: IC4.G20(IO_L8N_T1_AD10N_15)
EXT6.LVDS_N3: IC4.J17(IO_L21N_T3_DQS_A18_15)
EXT6.LVDS_N4: IC4.H14(IO_L3N_T0_DQS_AD1N_15)
EXT6.LVDS_N5: IC4.H22(IO_L7N_T1_AD2N_15)
EXT6.LVDS_N6: IC4.G13(IO_L1N_T0_AD0N_15)
EXT6.LVDS_N7: IC4.G16(IO_L2N_T0_AD8N_15)
EXT6.LVDS_P0: IC4.J19(IO_L12P_T1_MRCC_15)
EXT6.LVDS_P1: IC4.H17(IO_L6P_T0_15)
EXT6.LVDS_P2: IC4.H20(IO_L8P_T1_AD10P_15)
EXT6.LVDS_P3: IC4.K17(IO_L21P_T3_DQS_15)
EXT6.LVDS_P4: IC4.J14(IO_L3P_T0_DQS_AD1P_15)
EXT6.LVDS_P5: IC4.J22(IO_L7P_T1_AD2P_15)
EXT6.LVDS_P6: IC4.H13(IO_L1P_T0_AD0P_15)
EXT6.LVDS_P7: IC4.G15(IO_L2P_T0_AD8P_15)
EXT7.LVDS_N0: IC4.D19(IO_L14N_T2_SRCC_16)
EXT7.LVDS_N1: IC4.G22(IO_L24N_T3_16)
EXT7.LVDS_N2: IC4.F20(IO_L18N_T2_16)
EXT7.LVDS_N3: IC4.F14(IO_L1N_T0_16)
EXT7.LVDS_N4: IC4.E14(IO_L4N_T0_16)
EXT7.LVDS_N5: IC4.D15(IO_L6N_T0_VREF_16)
EXT7.LVDS_N6: IC4.E18(IO_L15N_T2_DQS_16)
EXT7.LVDS_N7: IC4.E17(IO_L2N_T0_16)
EXT7.LVDS_P0: IC4.E19(IO_L14P_T2_SRCC_16)
EXT7.LVDS_P1: IC4.G21(IO_L24P_T3_16)
EXT7.LVDS_P2: IC4.F19(IO_L18P_T2_16)
EXT7.LVDS_P3: IC4.F13(IO_L1P_T0_16)
EXT7.LVDS_P4: IC4.E13(IO_L4P_T0_16)
EXT7.LVDS_P5: IC4.D14(IO_L6P_T0_16)
EXT7.LVDS_P6: IC4.F18(IO_L15P_T2_DQS_16)
EXT7.LVDS_P7: IC4.F16(IO_L2P_T0_16)
EXT8.LVDS_N0: IC4.C17(IO_L12N_T1_MRCC_16)
EXT8.LVDS_N1: IC4.A16(IO_L9N_T1_DQS_16)
EXT8.LVDS_N2: IC4.A19(IO_L17N_T2_16)
EXT8.LVDS_N3: IC4.B13(IO_L8N_T1_16)
EXT8.LVDS_N4: IC4.C15(IO_L3N_T0_DQS_16)
EXT8.LVDS_N5: IC4.D16(IO_L5N_T0_16)
EXT8.LVDS_N6: IC4.A21(IO_L21N_T3_DQS_16)
EXT8.LVDS_N7: IC4.D22(IO_L22N_T3_16)
EXT8.LVDS_P0: IC4.D17(IO_L12P_T1_MRCC_16)
EXT8.LVDS_P1: IC4.A15(IO_L9P_T1_DQS_16)
EXT8.LVDS_P2: IC4.A18(IO_L17P_T2_16)
EXT8.LVDS_P3: IC4.C13(IO_L8P_T1_16)
EXT8.LVDS_P4: IC4.C14(IO_L3P_T0_DQS_16)
EXT8.LVDS_P5: IC4.E16(IO_L5P_T0_16)
EXT8.LVDS_P6: IC4.B21(IO_L21P_T3_DQS_16)
EXT8.LVDS_P7: IC4.E22(IO_L22P_T3_16)
EXT9.LVDS_N0: IC4.C19(IO_L13N_T2_MRCC_16)
EXT9.LVDS_N1: IC4.A14(IO_L10N_T1_16)
EXT9.LVDS_N2: IC4.A20(IO_L16N_T2_16)
EXT9.LVDS_N3: IC4.B16(IO_L7N_T1_16)
EXT9.LVDS_N4: IC4.C20(IO_L19N_T3_VREF_16)
EXT9.LVDS_N5: IC4.B18(IO_L11N_T1_SRCC_16)
EXT9.LVDS_N6: IC4.B22(IO_L20N_T3_16)
EXT9.LVDS_N7: IC4.D21(IO_L23N_T3_16)
EXT9.LVDS_P0: IC4.C18(IO_L13P_T2_MRCC_16)
EXT9.LVDS_P1: IC4.A13(IO_L10P_T1_16)
EXT9.LVDS_P2: IC4.B20(IO_L16P_T2_16)
EXT9.LVDS_P3: IC4.B15(IO_L7P_T1_16)
EXT9.LVDS_P4: IC4.D20(IO_L19P_T3_16)
EXT9.LVDS_P5: IC4.B17(IO_L11P_T1_SRCC_16)
EXT9.LVDS_P6: IC4.C22(IO_L20P_T3_16)
EXT9.LVDS_P7: IC4.E21(IO_L23P_T3_16)
EXT10.LVDS_N0: IC4.V15(IO_L14N_T2_SRCC_13)
EXT10.LVDS_N1: IC4.AA16(IO_L1N_T0_13)
EXT10.LVDS_N2: IC4.AB17(IO_L2N_T0_13)
EXT10.LVDS_N3: IC4.AB15(IO_L4N_T0_13)
EXT10.LVDS_N4: IC4.AA14(IO_L5N_T0_13)
EXT10.LVDS_N5: IC4.AB13(IO_L3N_T0_DQS_13)
EXT10.LVDS_N6: IC4.W12(IO_L12N_T1_MRCC_13)
EXT10.LVDS_N7: IC4.AB12(IO_L7N_T1_13)
EXT10.LVDS_P0: IC4.U15(IO_L14P_T2_SRCC_13)
EXT10.LVDS_P1: IC4.Y16(IO_L1P_T0_13)
EXT10.LVDS_P2: IC4.AB16(IO_L2P_T0_13)
EXT10.LVDS_P3: IC4.AA15(IO_L4P_T0_13)
EXT10.LVDS_P4: IC4.Y13(IO_L5P_T0_13)
EXT10.LVDS_P5: IC4.AA13(IO_L3P_T0_DQS_13)
EXT10.LVDS_P6: IC4.W11(IO_L12P_T1_MRCC_13)
EXT10.LVDS_P7: IC4.AB11(IO_L7P_T1_13)
EXT11.LVDS_N0: IC4.Y12(IO_L11N_T1_SRCC_13)
EXT11.LVDS_N1: IC4.T15(IO_L15N_T2_DQS_13)
EXT11.LVDS_N2: IC4.W16(IO_L16N_T2_13)
EXT11.LVDS_N3: IC4.Y14(IO_L6N_T0_VREF_13)
EXT11.LVDS_N4: IC4.V14(IO_L13N_T2_MRCC_13)
EXT11.LVDS_N5: IC4.W10(IO_L10N_T1_13)
EXT11.LVDS_N6: IC4.AA11(IO_L9N_T1_DQS_13)
EXT11.LVDS_N7: IC4.AB10(IO_L8N_T1_13)
EXT11.LVDS_P0: IC4.Y11(IO_L11P_T1_SRCC_13)
EXT11.LVDS_P1: IC4.T14(IO_L15P_T2_DQS_13)
EXT11.LVDS_P2: IC4.W15(IO_L16P_T2_13)
EXT11.LVDS_P3: IC4.W14(IO_L6P_T0_13)
EXT11.LVDS_P4: IC4.V13(IO_L13P_T2_MRCC_13)
EXT11.LVDS_P5: IC4.V10(IO_L10P_T1_13)
EXT11.LVDS_P6: IC4.AA10(IO_L9P_T1_DQS_13)
EXT11.LVDS_P7: IC4.AA9(IO_L8P_T1_13)
FAN_PWM: C159.2 IC4.N17(IO_L21P_T3_DQS_14)
FPGA_TESTPOINT0: IC4.T21(IO_L4P_T0_D04_14) TP26.1
GPIO_INT0: IC4.U18(IO_L18N_T2_A11_D27_14)
GPIO_INT1: IC4.R17(IO_L24N_T3_A00_D16_14)
Helper_DCXO_N: IC4.W20(IO_L12N_T1_MRCC_14) ; port Helper_DCXO_N
Helper_DCXO_P: IC4.W19(IO_L12P_T1_MRCC_14) ; port Helper_DCXO_P
Helper_DCXO_SCL: IC4.N13(IO_L23P_T3_A03_D19_14) ; port CDR_PLL_CTRL.Helper_DCXO_SCL
Helper_DCXO_SDA: IC4.N15(IO_25_14) ; port CDR_PLL_CTRL.Helper_DCXO_SDA
HW_REV0: IC4.T16(IO_L17P_T2_13) ; port HW_REV.HW_REV0
HW_REV1: IC4.U16(IO_L17N_T2_13) ; port HW_REV.HW_REV1
HW_REV2: IC4.T3(IO_0_34) ; port HW_REV.HW_REV2
HW_REV3: IC4.F21(IO_25_16) ; port HW_REV.HW_REV3
I2C_SW_RESET: IC4.U17(IO_L18P_T2_A12_D28_14) ; port I2C_SW_RESET
I2C_SW_SCL: IC4.J16(IO_0_15) ; port I2C_SW_SCL
I2C_SW_SDA: IC4.M17(IO_25_15) ; port I2C_SW_SDA
LED_ERR: IC4.F15(IO_0_16) R23.2 T12.1(G)
LED_USER0: IC4.P14(IO_L19P_T3_A10_D26_14) R45.2 T3.1(G)
LED_USER1: IC4.R19(IO_L5N_T0_D07_14) R227.2 T19.1(G)
LED_USER2: IC4.R16(IO_L22N_T3_A04_D20_14) R19.2 T2.1(G)
Main_DCXO_SCL: IC4.U7(IO_25_34) ; port CDR_PLL_CTRL.Main_DCXO_SCL
Main_DCXO_SDA: IC4.N14(IO_L23N_T3_A02_D18_14) ; port CDR_PLL_CTRL.Main_DCXO_SDA
P3V3_EEM_EN: NT1.2 ; port EEM_PWR_MGMT.P3V3_EN
P3V3_EEM_FLT_N: NT2.2 ; port EEM_PWR_MGMT.P3V3_FLT_N
RxD_2V5: IC4.P17(IO_L21N_T3_DQS_A06_D22_14) ; port RxD_2V5
TxD_2V5: IC4.P16(IO_L24P_T3_A01_D17_14) ; port TxD_2V5
NetC159_1: C159.1 D17.2(A) R150.1 T20.1(G)
NetD18_2: D18.2(A) J21.1 T20.3(D)
NetLD2_1: LD2.1(C) T3.3(D)
NetLD2_2: LD2.2(A) R44.1
NetLD13_1: LD13.1(C) T2.3(D)
NetLD13_2: LD13.2(A) R11.1
NetLD14_1: LD14.1(C) T12.3(D)
NetLD14_2: LD14.2(A) R20.1
NetLD18_1: LD18.1(C) T19.3(D)
NetLD18_2: LD18.2(A) R226.1

Not connected (* = marked no-connect by the designer): IC4 R14(IO_L19N_T3_A09_D25_VREF_14)* Y17(IO_0_13)*

### Buses and harness runs
bus EXT0.LVDS_N[7..0]
bus EXT0.LVDS_P[7..0]
bus EXT1.LVDS_N[7..0]
bus EXT1.LVDS_P[7..0]
bus EXT2.LVDS_N[7..0]
bus EXT2.LVDS_P[7..0]
bus EXT3.LVDS_N[7..0]
bus EXT3.LVDS_P[7..0]
bus EXT4.LVDS_N[7..0]
bus EXT4.LVDS_P[7..0]
bus EXT5.LVDS_N[7..0]
bus EXT5.LVDS_P[7..0]
bus EXT6.LVDS_N[7..0]
bus EXT6.LVDS_P[7..0]
bus EXT7.LVDS_N[7..0]
bus EXT7.LVDS_P[7..0]
bus EXT8.LVDS_N[7..0]
bus EXT8.LVDS_P[7..0]
bus EXT9.LVDS_N[7..0]
bus EXT9.LVDS_P[7..0]
bus EXT10.LVDS_N[7..0]
bus EXT10.LVDS_P[7..0]
bus EXT11.LVDS_N[7..0]
bus EXT11.LVDS_P[7..0]
bus GPIO_INT[1..0] = port GPIO_INT[1..0]
harness EXT0 = port EXT0
harness EXT1 = port EXT1
harness EXT2 = port EXT2
harness EXT3 = port EXT3
harness EXT4 = port EXT4
harness EXT5 = port EXT5
harness EXT6 = port EXT6
harness EXT7 = port EXT7
harness EXT8 = port EXT8
harness EXT9 = port EXT9
harness EXT10 = port EXT10
harness EXT11 = port EXT11

### Layout directives
differential pair; differential pair class Diff_100Ohm: (no net found under the mark), CLK_SMA_IN_N, CLK_SMA_IN_P, CLKREC_N, CLKREC_P, Helper_DCXO_N, Helper_DCXO_P
differential pair; differential pair class LVPECL: CK_FPGAIO_N, CK_FPGAIO_P

### Notes on the sheet
- All LVDS_0 lines are capable of clock input.
- Use FPGA internal pull-up for EEM_FLT_N
- (near R9) Termination resistor value is closest to single ended impedance of _P trace.
- Board LED
- LED_USER1, 2 and LED_ERR are located on the front panel.
- Project/Equipment
- Document
- Designer
- Drawn by
- Check.by
- Copyright WUT 2022.
  This documentation describes Open Hardware and is licensed under the CERN OHL v. 1.2. You may redistribute and modify this documentation under the terms of the CERN OHL v.1.2. (http://ohwr.org/cernohl). This documentation is distributed WITHOUT ANY EXPRESS OR IMPLIED WARRANTY, INCLUDING OF MERCHANTABILITY, SATISFACTORY QUALITY AND FITNESS FOR A PARTICULAR PURPOSE. Please see the CERN OHL v.1.2 for applicable conditions
- File
- Last Mod.
- Print Date
- Sheet
- Size
- A3
- of
- Rev
- (in symbol R0402_1K_1%_0.0625W_100PPM) 1%
- (in symbol R0402_1k_1%_0.0625W_100PPM) 1%
- (in symbol R0402_2K2_1%_0.0625W_100PPM) 1%
- (in symbol R0402_10k_1%_0.0625W_100PPM) 1%
- (in symbol R0402_68R_1%_0.0625W_100PPM) 1%
- (in symbol R0402_240R_1%_0.0625W_100PPM) 1%
- (in symbol XC7A100T-3FGG484E, part A) BANK 13
- (in symbol XC7A100T-3FGG484E, part B) BANK 14
- (in symbol XC7A100T-3FGG484E, part C) BANK 15
- (in symbol XC7A100T-3FGG484E, part D) BANK 16
- (in symbol XC7A100T-3FGG484E, part E) BANK 34

### Library data of the parts
C159 = CC0201_100NF_6.3V_10%_X5R: as C161 on sheet TOP; Part Number: CC0201_100NF_6.3V_10%_X5R; Component Kind: Standard; Component Type: Standard; Pin Count: 2; Value: 100nF; Status: Not Recommended; Manufacturer Part Number: CC0201_100NF_6.3V_10%_X5R; Case: 0201; Mounted: Yes; Socket: No; SMD: Yes; Sense: No; Manufacturer1 Example: AVX; Manufacturer1 ComponentHeight: 0.33mm; HelpURL: \\cern.ch\dfs\Applications\Altium\Datasheets\CC0201_X5R_AVX.pdf; Author: CERN DEM JLC; CreateDate: 2007-12-03; LatestRevisionDate: 2007-12-03; ClassName: FPGA_JTAG
D17 D18 = BAT165: Schottky Diode; Part Description: Medium Power AF Schottky Diode; Manufacturer: INFINEON; Voltage: 40V; Power: 750mA; PressFit: No; Bonding: No; Part Number: BAT165; Component Kind: Standard; Component Type: Standard; Device: BAT165; PackageDescription: Small Outline Diode (SOD-323), 1.70mm W X 1.25mm L X 1.10mm H body,  IPC Medium Density; Manufacturer Part Number: BAT165; Pin Count: 2; Case: SOD323; Mounted: Yes; Socket: No; SMD: Yes; Sense: No; ComponentHeight: 1.1mm; HelpURL: \\cern.ch\dfs\Applications\Altium\Datasheets\BAT165.pdf; Author: CERN DEM JLC; CreateDate: 12.11.2014; LatestRevisionDate: 12.11.2014
IC4 = XC7A100T-3FGG484E: Artix-7 FPGA, 285 User I/Os, 4 GTP, 484-Ball BGA, Speed Grade 3, Extended Temperature Grade, Pb-Free; Manufacturer: XILINX; PressFit: No; Bonding: No; PackageDescription: BGA, 1.00mm Pitch, Square; 484 Pin, 22 Columns X 22 Rows, Body 23.00mm X 23.00mm X 2.60mm H, IPC Medium Density; ComponentLink2Description: Pinout; ComponentLink2URL: \\cern.ch\dfs\Applications\Altium\Datasheets\XC7A100T-3FGG484E_Pinout.pdf; ComponentLink1URL: \\cern.ch\dfs\Applications\Altium\Datasheets\XC7A100T-3FGG484E_Package-Pinout.pdf; ComponentLink1Description: Package/Pinout; Part Number: XC7A100T-3FGG484E; Component Kind: Standard; Component Type: Standard; Device: XC7A100T-3FGG484E; Part Description: Artix-7 FPGA, 285 User I/Os, 4 GTP, 484-Ball BGA, Speed Grade 3, Extended Temperature Grade, Pb-Free; Manufacturer Part Number: XC7A100T-3FGG484E; Pin Count: 484; Case: BGA484; Mounted: Yes; Socket: No; SMD: Yes; Sense: No; ComponentHeight: 2.6mm; HelpURL: \\cern.ch\dfs\Applications\Altium\Datasheets\XC7A100T-3FGG484E.pdf; Author: CERN DEM BC; CreateDate: 18.10.2019; LatestRevisionDate: 18.10.2019
J21 = MOLEX_22-27-2021: Connector 2 Male; Part Description: 2.54mm (.100") Pitch KK® Wire-to-Board Header, Vertical, with Friction Lock, 2 Circuits, Tin (Sn) Plating; Manufacturer: MOLEX; PressFit: No; Part Number: MOLEX_22-27-2021; Component Kind: Standard; Component Type: Standard; Pin Count: 2; Family: KK®; Mounted: Yes; Socket: No; SMD: No; Sense: No; Status: None; Manufacturer Part Number: 22-27-2021; ComponentHeight: 11.7mm; HelpURL: \\cern.ch\dfs\Applications\Altium\Datasheets\MOLEX_22-27-2021.pdf; Author: CERN DEM JLC; CreateDate: 04.12.2008; LatestRevisionDate: 04.12.2008
LD2 = LED_KINGBRIGHT_KPH-1608CGCK: LED Green 1C 2A; Part Description: SMD Green LED, Case 1.6mmX0.8mm(0603), 0.65mm Thickness; PressFit: No; Bonding: No; Manufacturer Part Number: KPH-1608CGCK; ComponentHeight: 0.65mm; HelpURL: \\cern.ch\dfs\Applications\Altium\Datasheets\LED_KINGBRIGHT_KPH-1608CGCK.pdf; Part Number: LED_KINGBRIGHT_KPH-1608CGCK; Component Kind: Standard; Component Type: Standard; Color: Green; PackageDescription: SMT Green LED, Case 0603, Body L 1.6 x W 0.8mm H 0.65mm; Manufacturer: KINGBRIGHT; Pin Count: 2; Mounted: Yes; Socket: No; SMD: Yes; Sense: No; Author: CERN DEM JLC; CreateDate: 03.07.2017; LatestRevisionDate: 03.07.2017
LD13 LD18 = LED_AVAGO_HSME-C120: LED Green 1C 2A; Part Description: High Performance Right Angle Chip Green LED; Manufacturer: AVAGO TECHNOLOGIES; PressFit: No; Bonding: No; Manufacturer Part Number: HSME-C120; ComponentHeight: 0.7mm; HelpURL: \\cern.ch\dfs\Applications\Altium\Datasheets\LED_AVAGO_HSME-C120.pdf; Part Number: LED_AVAGO_HSME-C120; Component Kind: Standard; Component Type: Standard; Color: Green; PackageDescription: Green Chip LED, 2-Leads, Body 1.7x1.1mm, Side Emitting Package; Pin Count: 2; Mounted: Yes; Socket: No; SMD: Yes; Sense: No; Author: CERN DEM JMW; CreateDate: 22.07.2009; LatestRevisionDate: 20.06.2012; ComponentLink1URL: \\cern.ch\dfs\Applications\Altium\Datasheets\LED_AVAGO_HSME-C110_DESIGN-GUIDE.pdf; ComponentLink1Description: Design Guide
LD14 = LED_AVAGO_HSMC-C120: LED Red 1C 2A; Part Description: High Performance Right Angle Chip Red LED; Manufacturer: AVAGO TECHNOLOGIES; PressFit: No; Bonding: No; Manufacturer Part Number: HSMC-C120; ComponentHeight: 0.7mm; HelpURL: \\cern.ch\dfs\Applications\Altium\Datasheets\LED_AVAGO_HSMC-C120.pdf; Part Number: LED_AVAGO_HSMC-C120; Component Kind: Standard; Component Type: Standard; Color: Red; PackageDescription: Red Chip LED, 2-Leads, Body 1.7x1.1mm, Side Emitting Package; Pin Count: 2; Mounted: Yes; Socket: No; SMD: Yes; Sense: No; Author: CERN DEM JMW; CreateDate: 2009-07-22; LatestRevisionDate: 2012-06-20; ComponentLink1URL: \\cern.ch\dfs\Applications\Altium\Datasheets\LED_AVAGO_HSMC-C120_DESIGN-GUIDE.pdf; ComponentLink1Description: Design Guide
NT1 NT2 = Net Tie: Part Description: Net Tie (2 Nets); Mounted: No; Part Number: Net Tie; Component Type: Net Tie; Pin Count: 2; Family: Net Tie; Socket: No; SMD: No; Sense: No; Status: None; ComponentHeight: 0mm; HelpURL: Undefined; Author: CERN DEM JLC; CreateDate: 22.03.2011; LatestRevisionDate: 22.03.2011; PackageDescription: 2 Plated Through Hole For Coaxial Cable Link: Hole Dia.=1.4mm Pad Dia.=2.5mm
R9 = R0402_68R_1%_0.0625W_100PPM: Resistor - 1%; Part Description: General Purpose Thick Film Chip Resistor; Manufacturer: GENERIC; Manufacturer1 Part Number: 232270676809L; TC: ±100ppm/°C; PressFit: No; Part Number: R0402_68R_1%_0.0625W_100PPM; Component Kind: Standard; Component Type: Standard; Pin Count: 2; Value: 68; Status: Not Recommended; Power: 0.0625W; Tolerance: ±1%; Manufacturer Part Number: R0402_68R_1%_0.0625W_100PPM; Case: 0402; Mounted: Yes; Sense: No; Socket: No; SMD: Yes; Manufacturer1 Example: YAGEO PHYCOMP; Manufacturer1 ComponentHeight: 0.4mm; HelpURL: \\cern.ch\dfs\Applications\Altium\Datasheets\R0402_Phycomp_RC0402.pdf; Author: CERN DEM JLC; CreateDate: 03.12.2007; LatestRevisionDate: 17.10.2012
R11 R20 R226 = R0402_240R_1%_0.0625W_100PPM: Resistor - 1%; Part Description: General Purpose Thick Film Chip Resistor; Manufacturer: GENERIC; Manufacturer1 Part Number: 232270672401L; TC: ±100ppm/°C; PressFit: No; Part Number: R0402_240R_1%_0.0625W_100PPM; Component Kind: Standard; Component Type: Standard; Pin Count: 2; Value: 240; Status: Not Recommended; Power: 0.0625W; Tolerance: ±1%; Manufacturer Part Number: R0402_240R_1%_0.0625W_100PPM; Case: 0402; Mounted: Yes; Sense: No; Socket: No; SMD: Yes; Manufacturer1 Example: YAGEO PHYCOMP; Manufacturer1 ComponentHeight: 0.4mm; HelpURL: \\cern.ch\dfs\Applications\Altium\Datasheets\R0402_Phycomp_RC0402.pdf; Author: CERN DEM JLC; CreateDate: 03.12.2007; LatestRevisionDate: 17.10.2012
R19 R23 R45 R227 = R0402_2K2_1%_0.0625W_100PPM: as R94 on sheet TOP; Part Number: R0402_2K2_1%_0.0625W_100PPM; Component Kind: Standard; Component Type: Standard; Pin Count: 2; Value: 2k2; Status: Not Recommended; Power: 0.0625W; Tolerance: ±1%; Manufacturer Part Number: R0402_2K2_1%_0.0625W_100PPM; Case: 0402; Mounted: Yes; Sense: No; Socket: No; SMD: Yes; Manufacturer1 Example: YAGEO PHYCOMP; Manufacturer1 ComponentHeight: 0.4mm; HelpURL: \\cern.ch\dfs\Applications\Altium\Datasheets\R0402_Phycomp_RC0402.pdf; Author: CERN DEM JLC; CreateDate: 03.12.2007; LatestRevisionDate: 17.10.2012; ClassName: Artix
R42 R43 = R0402_1K_1%_0.0625W_100PPM: Resistor - 1%; Part Description: General Purpose Thick Film Chip Resistor; Manufacturer: GENERIC; Manufacturer1 Part Number: 232270671002L; TC: ±100ppm/°C; PressFit: No; Part Number: R0402_1K_1%_0.0625W_100PPM; Component Kind: Standard; Component Type: Standard; Pin Count: 2; Value: 1k; Status: Not Recommended; Power: 0.0625W; Tolerance: ±1%; Manufacturer Part Number: R0402_1K_1%_0.0625W_100PPM; Case: 0402; Mounted: Yes; Sense: No; Socket: No; SMD: Yes; Manufacturer1 Example: YAGEO PHYCOMP; Manufacturer1 ComponentHeight: 0.4mm; HelpURL: \\cern.ch\dfs\Applications\Altium\Datasheets\R0402_Phycomp_RC0402.pdf; Author: CERN DEM JLC; CreateDate: 03.12.2007; LatestRevisionDate: 17.10.2012; ClassName: Artix
R44 = R0402_1k_1%_0.0625W_100PPM: Resistor - 1%; Part Description: General Purpose Thick Film Chip Resistor; Manufacturer: GENERIC; Manufacturer1 Part Number: 232270671002L; TC: ±100ppm/°C; PressFit: No; Part Number: R0402_1K_1%_0.0625W_100PPM; Component Kind: Standard; Component Type: Standard; Pin Count: 2; Value: 1k; Status: Not Recommended; Power: 0.0625W; Tolerance: ±1%; Manufacturer Part Number: R0402_1K_1%_0.0625W_100PPM; Case: 0402; Mounted: Yes; Sense: No; Socket: No; SMD: Yes; Manufacturer1 Example: YAGEO PHYCOMP; Manufacturer1 ComponentHeight: 0.4mm; HelpURL: \\cern.ch\dfs\Applications\Altium\Datasheets\R0402_Phycomp_RC0402.pdf; Author: CERN DEM JLC; CreateDate: 03.12.2007; LatestRevisionDate: 17.10.2012; ClassName: Artix
R150 R258 = R0402_10k_1%_0.0625W_100PPM: Resistor - 1%; Part Description: General Purpose Thick Film Chip Resistor; Manufacturer: GENERIC; Manufacturer1 Part Number: 232270671003L; TC: ±100ppm/°C; PressFit: No; Part Number: R0402_10K_1%_0.0625W_100PPM; Component Kind: Standard; Component Type: Standard; Pin Count: 2; Value: 10k; Status: Not Recommended; Power: 0.0625W; Tolerance: ±1%; Manufacturer Part Number: R0402_10K_1%_0.0625W_100PPM; Case: 0402; Mounted: Yes; Sense: No; Socket: No; SMD: Yes; Manufacturer1 Example: YAGEO PHYCOMP; Manufacturer1 ComponentHeight: 0.4mm; HelpURL: \\cern.ch\dfs\Applications\Altium\Datasheets\R0402_Phycomp_RC0402.pdf; Author: CERN DEM JLC; CreateDate: 03.12.2007; LatestRevisionDate: 17.10.2012
SW1 = SW_OMRON_B3U-3000PM: 1 Ways SPST DIP Switch; Part Description: Ultra-small Surface-mounting Tactile Switche with High Contact Reliability, Side-actuated, Contact Rating 50mA 12VDC; Manufacturer: OMRON; PressFit: No; Sense Comment: Non-washable; Part Number: SW_OMRON_B3U-3000PM; Component Kind: Standard; Component Type: Standard; Pin Count: 2; PackageDescription: Body 3.2x4.0mm, SPST Surface-Mounting Tactile Switch with Side Actuator (B3U Series); Family: Switch; Mounted: Yes; Socket: No; SMD: Yes; Sense: Yes; Status: None; Manufacturer Part Number: B3U-3000PM; ComponentHeight: 1.35mm; HelpURL: \\cern.ch\dfs\Applications\Altium\Datasheets\SW_OMRON_B3U.pdf; Author: CERN DEM HF; CreateDate: 04.10.2022; LatestRevisionDate: 04.10.2022
T2 T3 T12 T19 T20 = BSH103: N-CHANNEL MOSFET WITH DIODE; Part Description: 30V 850mA N-Channel Enhancement Mode Field-Effect Transistor; Manufacturer: NEXPERIA; PressFit: No; Bonding: No; Part Number: BSH103; Component Kind: Standard; Component Type: Standard; Device: BSH103; PackageDescription: SOT23, 3 pin, Pitch 0.95mm - 1.3mm W X 2.9mm L X 1.1mm H, IPC Medium Density; Manufacturer Part Number: BSH103; Pin Count: 3; Case: SOT23-3; Mounted: Yes; Socket: No; SMD: Yes; Sense: No; ComponentHeight: 1.1mm; HelpURL: \\cern.ch\dfs\Applications\Altium\Datasheets\BSH103.pdf; Author: CERN DEM JLC; CreateDate: 16.03.2010; LatestRevisionDate: 20.06.2017; ClassName: Artix
TP26-TP33 = PLATED_HOLE1.0_PAD1.7: Single Terminal Socket; Part Description: Plated Through Hole: Hole Dia.=1.0mm Pad Dia.=1.7mm,  IPC-7251 Level A; Mounted: No; Part Number: PLATED_HOLE1.0_PAD1.7; Component Type: Standard (No BOM); Pin Count: 1; Family: Plated Hole; Socket: No; SMD: No; Sense: No; Status: None; ComponentHeight: 0mm; HelpURL: Undefined; Author: CERN DEM JLC; CreateDate: 11.05.2017; LatestRevisionDate: 11.05.2017; PackageDescription: Plated Through Hole: Hole Dia.=1.0mm Pad Dia.=1.7mm,  IPC-7251 Level A